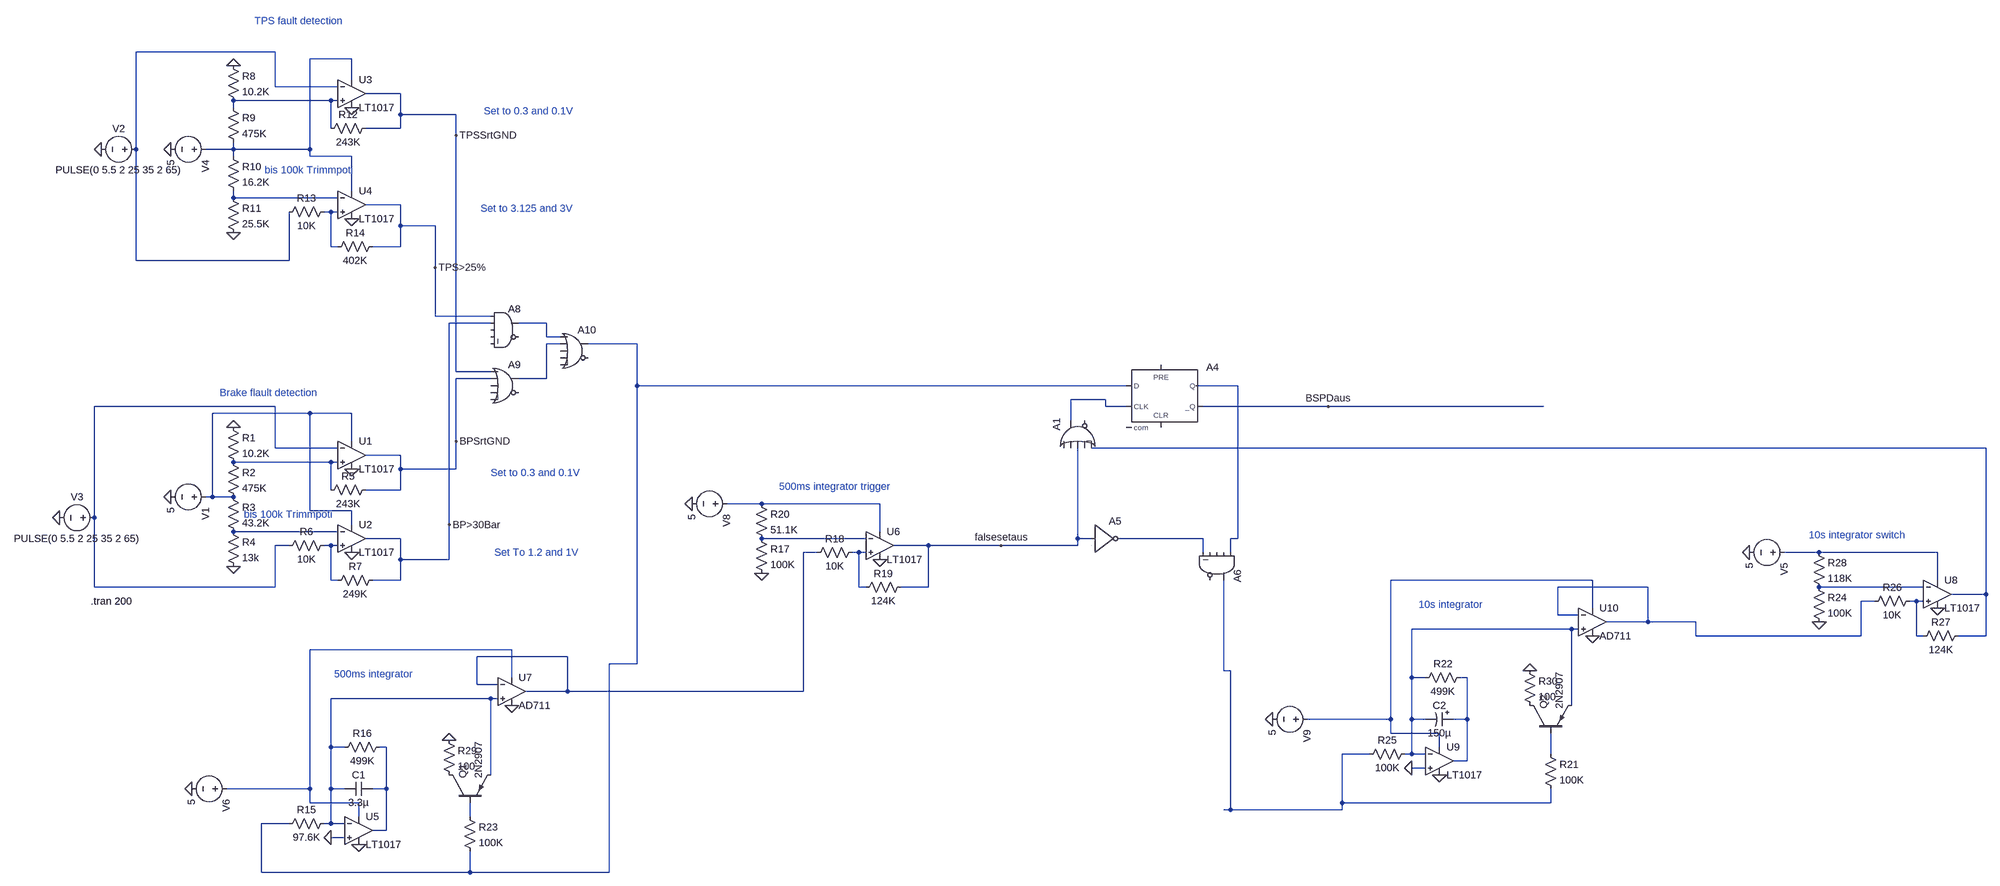
[diagram p0: schematic SpiceSimulationVer1.1.asc]
SpiceSimulationVer1.1.asc, the LTspice schematic file:
Version 4
SHEET 1 4232 2532
WIRE 144 544 -176 544
WIRE 320 560 224 560
WIRE 320 608 320 560
WIRE 144 624 144 544
WIRE 288 624 144 624
WIRE 432 640 352 640
WIRE 272 656 48 656
WIRE 288 656 272 656
WIRE 48 672 48 656
WIRE 432 688 432 640
WIRE 560 688 432 688
WIRE 272 720 272 656
WIRE 432 720 432 688
WIRE 432 720 352 720
WIRE 560 736 560 688
WIRE -176 768 -176 544
WIRE 48 768 48 752
WIRE 48 768 -16 768
WIRE 224 768 224 560
WIRE 224 768 48 768
WIRE 48 784 48 768
WIRE 224 784 224 768
WIRE 320 784 224 784
WIRE 320 864 320 784
WIRE 48 880 48 864
WIRE 288 880 48 880
WIRE 432 896 352 896
WIRE 272 912 256 912
WIRE 288 912 272 912
WIRE 432 944 432 896
WIRE 512 944 432 944
WIRE 272 992 272 912
WIRE 288 992 272 992
WIRE 432 992 432 944
WIRE 432 992 368 992
WIRE -176 1024 -176 768
WIRE 176 1024 176 912
WIRE 176 1024 -176 1024
WIRE 512 1040 512 944
WIRE 512 1152 512 1040
WIRE 640 1152 512 1152
WIRE 640 1168 544 1168
WIRE 768 1168 704 1168
WIRE 768 1200 768 1168
WIRE 800 1200 768 1200
WIRE 800 1216 768 1216
WIRE 976 1216 864 1216
WIRE 560 1280 560 736
WIRE 640 1280 560 1280
WIRE 640 1296 560 1296
WIRE 768 1296 768 1216
WIRE 768 1296 704 1296
WIRE 976 1312 976 1216
WIRE 2160 1312 976 1312
WIRE 2416 1312 2320 1312
WIRE 2112 1344 2032 1344
WIRE 144 1360 -272 1360
WIRE 2112 1360 2112 1344
WIRE 2160 1360 2112 1360
WIRE 2624 1360 2336 1360
WIRE 3120 1360 2624 1360
WIRE 224 1376 0 1376
WIRE 320 1376 224 1376
WIRE 2032 1392 2032 1344
WIRE 320 1440 320 1376
WIRE 560 1440 560 1296
WIRE 144 1456 144 1360
WIRE 288 1456 144 1456
WIRE 4224 1456 2080 1456
WIRE 432 1472 352 1472
WIRE 272 1488 48 1488
WIRE 288 1488 272 1488
WIRE 432 1504 432 1472
WIRE 560 1504 560 1440
WIRE 560 1504 432 1504
WIRE 272 1552 272 1488
WIRE 432 1552 432 1504
WIRE 432 1552 352 1552
WIRE 0 1568 0 1376
WIRE 0 1568 -16 1568
WIRE 48 1568 0 1568
WIRE 1296 1584 1216 1584
WIRE 1568 1584 1296 1584
WIRE 224 1600 224 1376
WIRE 320 1600 224 1600
WIRE -272 1616 -272 1360
WIRE 320 1632 320 1600
WIRE 544 1632 544 1168
WIRE 288 1648 48 1648
WIRE 1568 1648 1568 1584
WIRE 432 1664 352 1664
WIRE 1536 1664 1296 1664
WIRE 2048 1664 2048 1456
WIRE 2080 1664 2048 1664
WIRE 2336 1664 2144 1664
WIRE 2416 1664 2416 1312
WIRE 2416 1664 2400 1664
WIRE 176 1680 144 1680
WIRE 272 1680 256 1680
WIRE 288 1680 272 1680
WIRE 1680 1680 1600 1680
WIRE 1872 1680 1680 1680
WIRE 2048 1680 2048 1664
WIRE 2048 1680 1872 1680
WIRE 1424 1696 1392 1696
WIRE 1520 1696 1504 1696
WIRE 1536 1696 1520 1696
WIRE 2336 1696 2336 1664
WIRE 2400 1696 2400 1664
WIRE 3840 1696 3760 1696
WIRE 4112 1696 3840 1696
WIRE 432 1712 432 1664
WIRE 544 1712 544 1632
WIRE 544 1712 432 1712
WIRE 272 1760 272 1680
WIRE 288 1760 272 1760
WIRE 432 1760 432 1712
WIRE 432 1760 368 1760
WIRE 3232 1760 2768 1760
WIRE 4112 1760 4112 1696
WIRE -272 1776 -272 1616
WIRE 144 1776 144 1680
WIRE 144 1776 -272 1776
WIRE 1520 1776 1520 1696
WIRE 1536 1776 1520 1776
WIRE 1680 1776 1680 1680
WIRE 1680 1776 1616 1776
WIRE 3360 1776 3152 1776
WIRE 4080 1776 3840 1776
WIRE 4224 1792 4224 1456
WIRE 4224 1792 4144 1792
WIRE 3968 1808 3936 1808
WIRE 4064 1808 4048 1808
WIRE 4080 1808 4064 1808
WIRE 3232 1824 3232 1760
WIRE 3152 1840 3152 1776
WIRE 3200 1840 3152 1840
WIRE 3360 1856 3360 1776
WIRE 3360 1856 3264 1856
WIRE 3488 1856 3360 1856
WIRE 3184 1872 2816 1872
WIRE 3200 1872 3184 1872
WIRE 3488 1888 3488 1856
WIRE 3936 1888 3936 1808
WIRE 3936 1888 3488 1888
WIRE 4064 1888 4064 1808
WIRE 4080 1888 4064 1888
WIRE 4224 1888 4224 1792
WIRE 4224 1888 4160 1888
WIRE 688 1920 224 1920
WIRE 816 1936 608 1936
WIRE 976 1952 976 1312
WIRE 976 1952 912 1952
WIRE 2384 1968 2384 1760
WIRE 2400 1968 2384 1968
WIRE 688 1984 688 1920
WIRE 2816 1984 2816 1872
WIRE 2848 1984 2816 1984
WIRE 2944 1984 2928 1984
WIRE 608 2000 608 1936
WIRE 656 2000 608 2000
WIRE 816 2016 816 1936
WIRE 816 2016 720 2016
WIRE 1392 2016 1392 1696
WIRE 1392 2016 816 2016
WIRE 640 2032 272 2032
WIRE 656 2032 640 2032
WIRE 3184 2048 3184 1872
WIRE 2768 2080 2768 1760
WIRE 2768 2080 2576 2080
WIRE 2816 2080 2816 1984
WIRE 2848 2080 2816 2080
WIRE 2944 2080 2944 1984
WIRE 2944 2080 2912 2080
WIRE 2768 2112 2768 2080
WIRE 2880 2112 2768 2112
WIRE 272 2144 272 2032
WIRE 304 2144 272 2144
WIRE 400 2144 384 2144
WIRE 2880 2144 2880 2112
WIRE 2720 2160 2656 2160
WIRE 2816 2160 2816 2080
WIRE 2816 2160 2800 2160
WIRE 2848 2160 2816 2160
WIRE 3136 2160 3136 2112
WIRE 2944 2176 2944 2080
WIRE 2944 2176 2912 2176
WIRE 2848 2192 2816 2192
WIRE 640 2208 640 2032
WIRE 224 2240 224 1920
WIRE 224 2240 32 2240
WIRE 272 2240 272 2144
WIRE 304 2240 272 2240
WIRE 400 2240 400 2144
WIRE 400 2240 368 2240
WIRE 224 2272 224 2240
WIRE 336 2272 224 2272
WIRE 2656 2272 2656 2160
WIRE 3136 2272 3136 2240
WIRE 3136 2272 2656 2272
WIRE 2400 2288 2400 1968
WIRE 2400 2288 2384 2288
WIRE 2656 2288 2656 2272
WIRE 2656 2288 2400 2288
WIRE 336 2304 336 2272
WIRE 592 2304 592 2272
WIRE 176 2320 112 2320
WIRE 272 2320 272 2240
WIRE 272 2320 256 2320
WIRE 304 2320 272 2320
WIRE 400 2336 400 2240
WIRE 400 2336 368 2336
WIRE 304 2352 272 2352
WIRE 112 2432 112 2320
WIRE 592 2432 592 2384
WIRE 592 2432 112 2432
WIRE 912 2432 912 1952
WIRE 912 2432 592 2432
FLAG 48 576 0
FLAG 48 960 0
FLAG -96 768 0
FLAG 320 672 0
FLAG 320 928 0
FLAG 48 1408 0
FLAG 48 1728 0
FLAG -96 1568 0
FLAG 320 1504 0
FLAG 320 1696 0
FLAG 336 2368 0
FLAG -48 2240 0
FLAG 272 2352 0
FLAG 1296 1744 0
FLAG 1568 1712 0
FLAG 1136 1584 0
FLAG 688 2048 0
FLAG 2880 2208 0
FLAG 2496 2080 0
FLAG 2816 2192 0
FLAG 3232 1888 0
FLAG 3840 1856 0
FLAG 4112 1824 0
FLAG 3680 1696 0
FLAG 1872 1680 falsesetaus
FLAG 2624 1360 BSPDaus
FLAG -256 768 0
FLAG -352 1616 0
FLAG 560 736 TPSSrtGND
FLAG 512 1040 TPS>25%
FLAG 560 1440 BPSrtGND
FLAG 544 1632 BP>30Bar
FLAG 3088 1968 0
FLAG 544 2128 0
SYMBOL res 32 560 R0
SYMATTR InstName R8
SYMATTR Value 10.2K
SYMATTR SpiceLine tol=1 pwr=0.1
SYMBOL res 32 656 R0
SYMATTR InstName R9
SYMATTR Value 475K
SYMATTR SpiceLine tol=1 pwr=0.1
SYMBOL res 32 768 R0
SYMATTR InstName R10
SYMATTR Value 16.2K
SYMATTR SpiceLine tol=1 pwr=0.1
SYMBOL res 32 864 R0
SYMATTR InstName R11
SYMATTR Value 25.5K
SYMATTR SpiceLine tol=1 pwr=0.1
SYMBOL Comparators\\LT1017 320 640 R0
SYMATTR InstName U3
SYMBOL Comparators\\LT1017 320 896 R0
SYMATTR InstName U4
SYMBOL res 368 704 R90
WINDOW 0 0 56 VBottom 2
WINDOW 3 32 56 VTop 2
SYMATTR InstName R12
SYMATTR Value 243K
SYMATTR SpiceLine tol=1 pwr=0.1
SYMBOL res 272 896 R90
WINDOW 0 0 56 VBottom 2
WINDOW 3 32 56 VTop 2
SYMATTR InstName R13
SYMATTR Value 10K
SYMATTR SpiceLine tol=1 pwr=0.1
SYMBOL res 384 976 R90
WINDOW 0 0 56 VBottom 2
WINDOW 3 32 56 VTop 2
SYMATTR InstName R14
SYMATTR Value 402K
SYMATTR SpiceLine tol=1 pwr=0.1
SYMBOL voltage 0 768 R90
WINDOW 123 0 0 Left 0
WINDOW 39 0 0 Left 0
SYMATTR InstName V4
SYMATTR Value 5
SYMBOL res 32 1392 R0
SYMATTR InstName R1
SYMATTR Value 10.2K
SYMATTR SpiceLine tol=1 pwr=0.1
SYMBOL res 32 1472 R0
SYMATTR InstName R2
SYMATTR Value 475K
SYMATTR SpiceLine tol=1 pwr=0.1
SYMBOL res 32 1552 R0
SYMATTR InstName R3
SYMATTR Value 43.2K
SYMATTR SpiceLine tol=1 pwr=0.1
SYMBOL res 32 1632 R0
SYMATTR InstName R4
SYMATTR Value 13k
SYMATTR SpiceLine tol=1 pwr=0.1
SYMBOL Comparators\\LT1017 320 1472 R0
SYMATTR InstName U1
SYMBOL Comparators\\LT1017 320 1664 R0
SYMATTR InstName U2
SYMBOL res 368 1536 R90
WINDOW 0 0 56 VBottom 2
WINDOW 3 32 56 VTop 2
SYMATTR InstName R5
SYMATTR Value 243K
SYMATTR SpiceLine tol=1 pwr=0.1
SYMBOL res 272 1664 R90
WINDOW 0 0 56 VBottom 2
WINDOW 3 32 56 VTop 2
SYMATTR InstName R6
SYMATTR Value 10K
SYMATTR SpiceLine tol=1 pwr=0.1
SYMBOL res 384 1744 R90
WINDOW 0 0 56 VBottom 2
WINDOW 3 32 56 VTop 2
SYMATTR InstName R7
SYMATTR Value 249K
SYMATTR SpiceLine tol=1 pwr=0.1
SYMBOL voltage 0 1568 R90
WINDOW 123 0 0 Left 0
WINDOW 39 0 0 Left 0
SYMATTR InstName V1
SYMATTR Value 5
SYMBOL res 272 2304 R90
WINDOW 0 0 56 VBottom 2
WINDOW 3 32 56 VTop 2
SYMATTR InstName R15
SYMATTR Value 97.6K
SYMATTR SpiceLine tol=1 pwr=0.1
SYMBOL cap 368 2224 R90
WINDOW 0 0 32 VBottom 2
WINDOW 3 32 32 VTop 2
SYMATTR InstName C1
SYMATTR Value 3.3µ
SYMATTR SpiceLine V=16 Irms=4.84 Rser=0.00925238 Lser=0 mfg="KEMET" pn="C1206C335K4RAC" type="X7R"
SYMBOL voltage 48 2240 R90
WINDOW 123 0 0 Left 0
WINDOW 39 0 0 Left 0
SYMATTR InstName V6
SYMATTR Value 5
SYMBOL res 1280 1648 R0
SYMATTR InstName R17
SYMATTR Value 100K
SYMATTR SpiceLine tol=1 pwr=0.1
SYMBOL Comparators\\LT1017 1568 1680 R0
SYMATTR InstName U6
SYMBOL res 1520 1680 R90
WINDOW 0 0 56 VBottom 2
WINDOW 3 32 56 VTop 2
SYMATTR InstName R18
SYMATTR Value 10K
SYMATTR SpiceLine tol=1 pwr=0.1
SYMBOL res 1632 1760 R90
WINDOW 0 0 56 VBottom 2
WINDOW 3 32 56 VTop 2
SYMATTR InstName R19
SYMATTR Value 124K
SYMATTR SpiceLine tol=1 pwr=0.1
SYMBOL res 1280 1568 R0
SYMATTR InstName R20
SYMATTR Value 51.1K
SYMATTR SpiceLine tol=1 pwr=0.1
SYMBOL voltage 1232 1584 R90
WINDOW 123 0 0 Left 0
WINDOW 39 0 0 Left 0
SYMATTR InstName V8
SYMATTR Value 5
SYMBOL Opamps\\AD711 688 1952 R0
SYMATTR InstName U7
SYMBOL pnp 544 2272 R270
SYMATTR InstName Q1
SYMATTR Value 2N2907
SYMBOL Digital\\dflop 2240 1264 R0
SYMATTR InstName A4
SYMATTR Value2 Vhigh=5 Vlow=0
SYMBOL Digital\\inv 2080 1600 R0
SYMATTR InstName A5
SYMATTR Value2 Vhigh=5 Vlow=0
SYMBOL Comparators\\LT1017 2880 2176 R0
SYMATTR InstName U9
SYMBOL res 2816 2144 R90
WINDOW 0 0 56 VBottom 2
WINDOW 3 32 56 VTop 2
SYMATTR InstName R25
SYMATTR Value 100K
SYMATTR SpiceLine tol=1 pwr=0.1
SYMBOL polcap 2912 2064 R90
WINDOW 0 0 32 VBottom 2
WINDOW 3 32 32 VTop 2
SYMATTR InstName C2
SYMATTR Value 150µ
SYMATTR SpiceLine V=16 Irms=1.75713 Rser=0.08 Lser=0 mfg="KEMET" pn="T521X157M016ATE080" type="Tantalum"
SYMATTR Description Capacitor
SYMATTR Type cap
SYMBOL voltage 2592 2080 R90
WINDOW 123 0 0 Left 0
WINDOW 39 0 0 Left 0
SYMATTR InstName V9
SYMATTR Value 5
SYMBOL Opamps\\AD711 3232 1792 R0
SYMATTR InstName U10
SYMBOL pnp 3088 2112 R270
SYMATTR InstName Q2
SYMATTR Value 2N2907
SYMBOL res 400 2128 R90
WINDOW 0 0 56 VBottom 2
WINDOW 3 32 56 VTop 2
SYMATTR InstName R16
SYMATTR Value 499K
SYMATTR SpiceLine tol=1 pwr=0.1
SYMBOL Digital\\and 2432 1728 R90
SYMATTR InstName A6
SYMATTR Value2 Vhigh=5 Vlow=0
SYMBOL res 576 2288 R0
SYMATTR InstName R23
SYMATTR Value 100K
SYMATTR SpiceLine tol=1 pwr=0.1
SYMBOL res 3120 2144 R0
SYMATTR InstName R21
SYMATTR Value 100K
SYMATTR SpiceLine tol=1 pwr=0.1
SYMBOL res 2944 1968 R90
WINDOW 0 0 56 VBottom 2
WINDOW 3 32 56 VTop 2
SYMATTR InstName R22
SYMATTR Value 499K
SYMATTR SpiceLine tol=1 pwr=0.1
SYMBOL res 3824 1760 R0
SYMATTR InstName R24
SYMATTR Value 100K
SYMATTR SpiceLine tol=1 pwr=0.1
SYMBOL Comparators\\LT1017 4112 1792 R0
SYMATTR InstName U8
SYMBOL res 4064 1792 R90
WINDOW 0 0 56 VBottom 2
WINDOW 3 32 56 VTop 2
SYMATTR InstName R26
SYMATTR Value 10K
SYMATTR SpiceLine tol=1 pwr=0.1
SYMBOL res 4176 1872 R90
WINDOW 0 0 56 VBottom 2
WINDOW 3 32 56 VTop 2
SYMATTR InstName R27
SYMATTR Value 124K
SYMATTR SpiceLine tol=1 pwr=0.1
SYMBOL res 3824 1680 R0
SYMATTR InstName R28
SYMATTR Value 118K
SYMATTR SpiceLine tol=1 pwr=0.1
SYMBOL voltage 3776 1696 R90
WINDOW 123 0 0 Left 0
WINDOW 39 0 0 Left 0
SYMATTR InstName V5
SYMATTR Value 5
SYMBOL Digital\\and 672 1120 R0
SYMATTR InstName A8
SYMATTR Value2 Vhigh=5 Vlow=0
SYMBOL Digital\\or 672 1248 R0
SYMATTR InstName A9
SYMATTR Value2 Vhigh=5 Vlow=0
SYMBOL Digital\\or 832 1168 R0
SYMATTR InstName A10
SYMATTR Value2 Vhigh=5 Vlow=0
SYMBOL voltage -160 768 R90
WINDOW 0 -32 56 VBottom 2
WINDOW 3 32 56 VTop 2
WINDOW 123 0 0 Left 0
WINDOW 39 0 0 Left 0
SYMATTR InstName V2
SYMATTR Value PULSE(0 5.5 2 25 35 2 65)
SYMBOL voltage -256 1616 R90
WINDOW 0 -32 56 VBottom 2
WINDOW 3 32 56 VTop 2
WINDOW 123 0 0 Left 0
WINDOW 39 0 0 Left 0
SYMATTR InstName V3
SYMATTR Value PULSE(0 5.5 2 25 35 2 65)
SYMBOL res 528 2112 R0
SYMATTR InstName R29
SYMATTR Value 100
SYMATTR SpiceLine tol=1 pwr=0.1
SYMBOL res 3072 1952 R0
SYMATTR InstName R30
SYMATTR Value 100
SYMBOL Digital\\or 1984 1424 R270
SYMATTR InstName A1
SYMATTR Value2 Vhigh=5 Vlow=0
SYMBOL Comparators\\LT1017 336 2336 R0
SYMATTR InstName U5
TEXT -280 1808 Left 2 !.tran 200
TEXT 280 1976 Left 2 ;500ms integrator
TEXT 1336 1544 Left 2 ;500ms integrator trigger
TEXT 2832 1816 Left 2 ;10s integrator
TEXT 3816 1656 Left 2 ;10s integrator switch
TEXT 96 472 Left 2 ;TPS fault detection
TEXT 16 1328 Left 2 ;Brake flault detection
TEXT 616 904 Left 2 ;Set to 3.125 and 3V
TEXT 624 680 Left 2 ;Set to 0.3 and 0.1V
TEXT 648 1696 Left 2 ;Set To 1.2 and 1V
TEXT 640 1512 Left 2 ;Set to 0.3 and 0.1V
TEXT 120 816 Left 2 ;bis 100k Trimmpoti
TEXT 72 1608 Left 2 ;bis 100k Trimmpoti

The netlist it stands for:
* SpiceSimulationVer1.1.asc
R8 0 N003 10.2K tol=1 pwr=0.1
R9 N003 N002 475K tol=1 pwr=0.1
R10 N002 N004 16.2K tol=1 pwr=0.1
R11 N004 0 25.5K tol=1 pwr=0.1
XU3 N003 N001 N002 0 TPSSrtGND LT1017  ; pins In+ In- V+ V- OUT
XU4 N005 N004 N002 0 TPS>25% LT1017  ; pins In+ In- V+ V- OUT
R12 TPSSrtGND N003 243K tol=1 pwr=0.1
R13 N005 N001 10K tol=1 pwr=0.1
R14 TPS>25% N005 402K tol=1 pwr=0.1
V4 N002 0 5
R1 0 N014 10.2K tol=1 pwr=0.1
R2 N014 N012 475K tol=1 pwr=0.1
R3 N012 N016 43.2K tol=1 pwr=0.1
R4 N016 0 13k tol=1 pwr=0.1
XU1 N014 N011 N012 0 BPSrtGND LT1017  ; pins In+ In- V+ V- OUT
XU2 N019 N016 N012 0 BP>30Bar LT1017  ; pins In+ In- V+ V- OUT
R5 BPSrtGND N014 243K tol=1 pwr=0.1
R6 N019 N011 10K tol=1 pwr=0.1
R7 BP>30Bar N019 249K tol=1 pwr=0.1
V1 N012 0 5
R15 N031 N008 97.6K tol=1 pwr=0.1
C1 N032 N031 3.3µ V=16 Irms=4.84 Rser=0.00925238 Lser=0 mfg="KEMET" pn="C1206C335K4RAC" type="X7R"
V6 N028 0 5
R17 N017 0 100K tol=1 pwr=0.1
XU6 N021 N017 N015 0 falsesetaus LT1017  ; pins In+ In- V+ V- OUT
R18 N021 N020 10K tol=1 pwr=0.1
R19 falsesetaus N021 124K tol=1 pwr=0.1
R20 N015 N017 51.1K tol=1 pwr=0.1
V8 N015 0 5
XU7 N031 N020 N028 0 N020 AD712  ; AD711, pins In+ In- V+ V- OUT
Q1 P001 N034 N031 0 2N2907
A4 N008 0 N010 0 0 BSPDaus N009 0 DFLOP Vhigh=5 Vlow=0
A5 falsesetaus 0 0 0 0 N018 0 0 BUF Vhigh=5 Vlow=0
XU9 0 N027 N023 0 N030 LT1017  ; pins In+ In- V+ V- OUT
R25 N027 N029 100K tol=1 pwr=0.1
C2 N030 N027 150µ V=16 Irms=1.75713 Rser=0.08 Lser=0 mfg="KEMET" pn="T521X157M016ATE080" type="Tantalum"
V9 N023 0 5
XU10 N027 N024 N023 0 N024 AD712  ; AD711, pins In+ In- V+ V- OUT
Q2 P002 N033 N027 0 2N2907
R16 N032 N031 499K tol=1 pwr=0.1
A6 N009 0 0 0 N018 0 N029 0 AND Vhigh=5 Vlow=0
R23 N034 N008 100K tol=1 pwr=0.1
R21 N033 N029 100K tol=1 pwr=0.1
R22 N030 N027 499K tol=1 pwr=0.1
R24 N025 0 100K tol=1 pwr=0.1
XU8 N026 N025 N022 0 N013 LT1017  ; pins In+ In- V+ V- OUT
R26 N026 N024 10K tol=1 pwr=0.1
R27 N013 N026 124K tol=1 pwr=0.1
R28 N022 N025 118K tol=1 pwr=0.1
V5 N022 0 5
A8 TPS>25% BP>30Bar 0 0 0 0 N006 0 AND Vhigh=5 Vlow=0
A9 TPSSrtGND BPSrtGND 0 0 0 0 N007 0 OR Vhigh=5 Vlow=0
A10 N006 N007 0 0 0 0 N008 0 OR Vhigh=5 Vlow=0
V2 N001 0 PULSE(0 5.5 2 25 35 2 65)
V3 N011 0 PULSE(0 5.5 2 25 35 2 65)
R29 0 P001 100 tol=1 pwr=0.1
R30 0 P002 100
A1 0 0 falsesetaus 0 N013 0 N010 0 OR Vhigh=5 Vlow=0
XU5 0 N031 N028 0 N032 LT1017  ; pins In+ In- V+ V- OUT
.model NPN NPN
.model PNP PNP
.lib standard.bjt
.tran 200
* 500ms integrator
* 500ms integrator trigger
* 10s integrator
* 10s integrator switch
* TPS fault detection
* Brake flault detection
* Set to 3.125 and 3V
* Set to 0.3 and 0.1V
* Set To 1.2 and 1V
* Set to 0.3 and 0.1V
* bis 100k Trimmpoti
* bis 100k Trimmpoti
.lib ADI1.lib
.backanno
.end